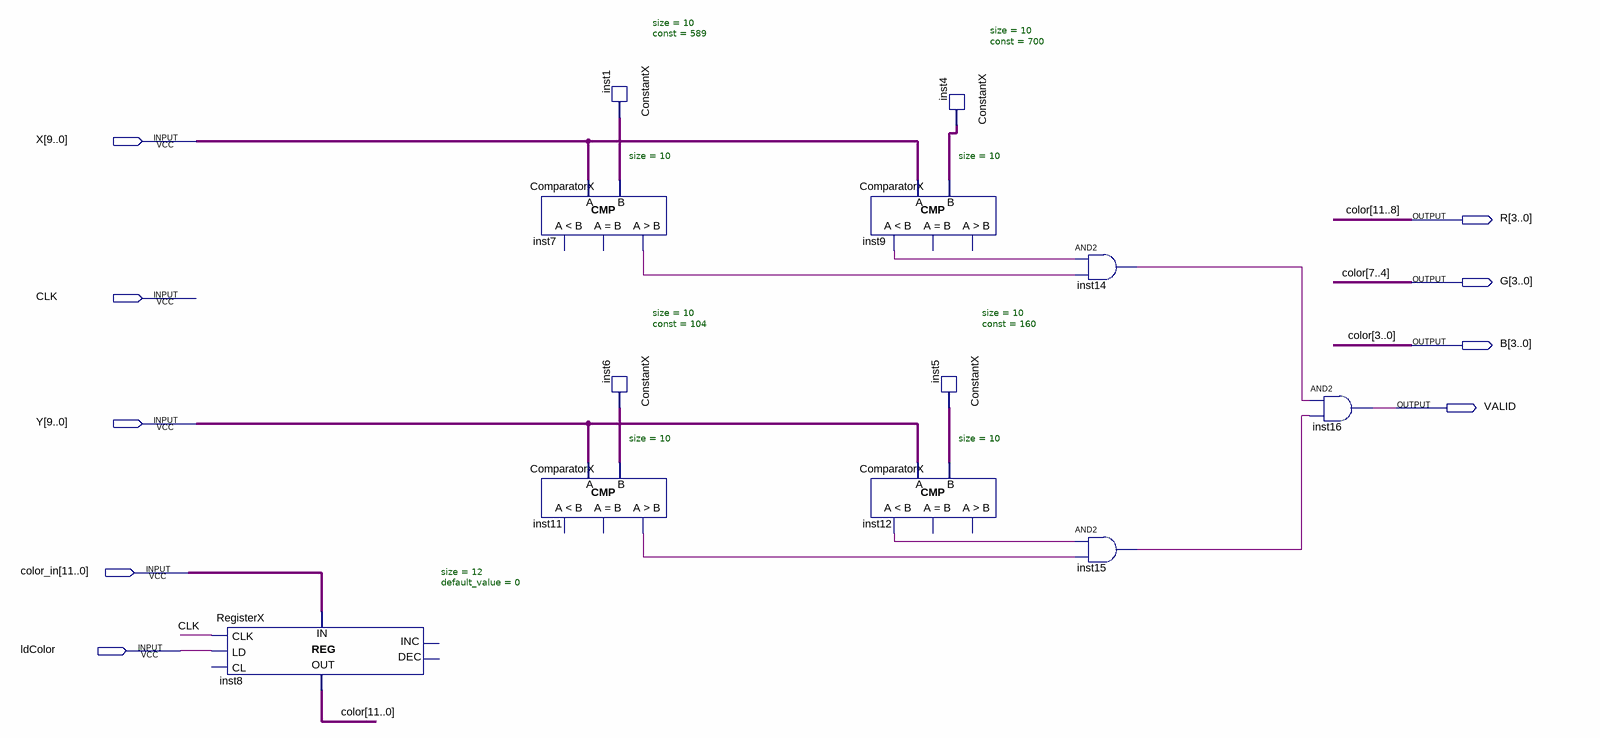
[diagram p0: schematic sheet]
// Quartus schematic Layer2.bdf as structural Verilog: 12 symbols, 9 pins
module Layer2 (
  input  [9:0] X,
  input  CLK,
  input  [9:0] Y,
  input  [11:0] color_in,
  input  ldColor,
  output [3:0] R,
  output [3:0] G,
  output [3:0] B,
  output VALID
);

  wire inst7_gr, inst9_ls, inst11_gr, inst12_ls, inst14_out, inst15_out;
  wire [9:0] inst1_data_out, inst4_data_out, inst5_data_out, inst6_data_out;

  RegisterX #(.size(12), .default_value(0)) inst8 (
    .CLK(CLK), .LD(ldColor), .DATA_IN(color_in), .DATA_OUT({R, G, B}));  // open: CL, INC, DEC
  ComparatorX #(.size(10)) inst7 (.A(X), .B(inst1_data_out), .GR(inst7_gr));  // open: LS, EQ
  ComparatorX #(.size(10)) inst11 (.A(Y), .B(inst6_data_out), .GR(inst11_gr));  // open: LS, EQ
  ConstantX #(.size(10), .\const (589)) inst1 (.DATA_OUT(inst1_data_out));
  ConstantX #(.size(10), .\const (104)) inst6 (.DATA_OUT(inst6_data_out));
  ComparatorX #(.size(10)) inst9 (.A(X), .B(inst4_data_out), .LS(inst9_ls));  // open: EQ, GR
  ComparatorX #(.size(10)) inst12 (.A(Y), .B(inst5_data_out), .LS(inst12_ls));  // open: EQ, GR
  ConstantX #(.size(10), .\const (700)) inst4 (.DATA_OUT(inst4_data_out));
  ConstantX #(.size(10), .\const (160)) inst5 (.DATA_OUT(inst5_data_out));
  and inst14 (inst14_out, inst9_ls, inst7_gr);
  and inst15 (inst15_out, inst12_ls, inst11_gr);
  and inst16 (VALID, inst14_out, inst15_out);

  // Other names for the same wires on the sheet: color[11:0] = {R, G, B}
endmodule
